# Altium schematic sheet PT1003.SchDoc
size A3
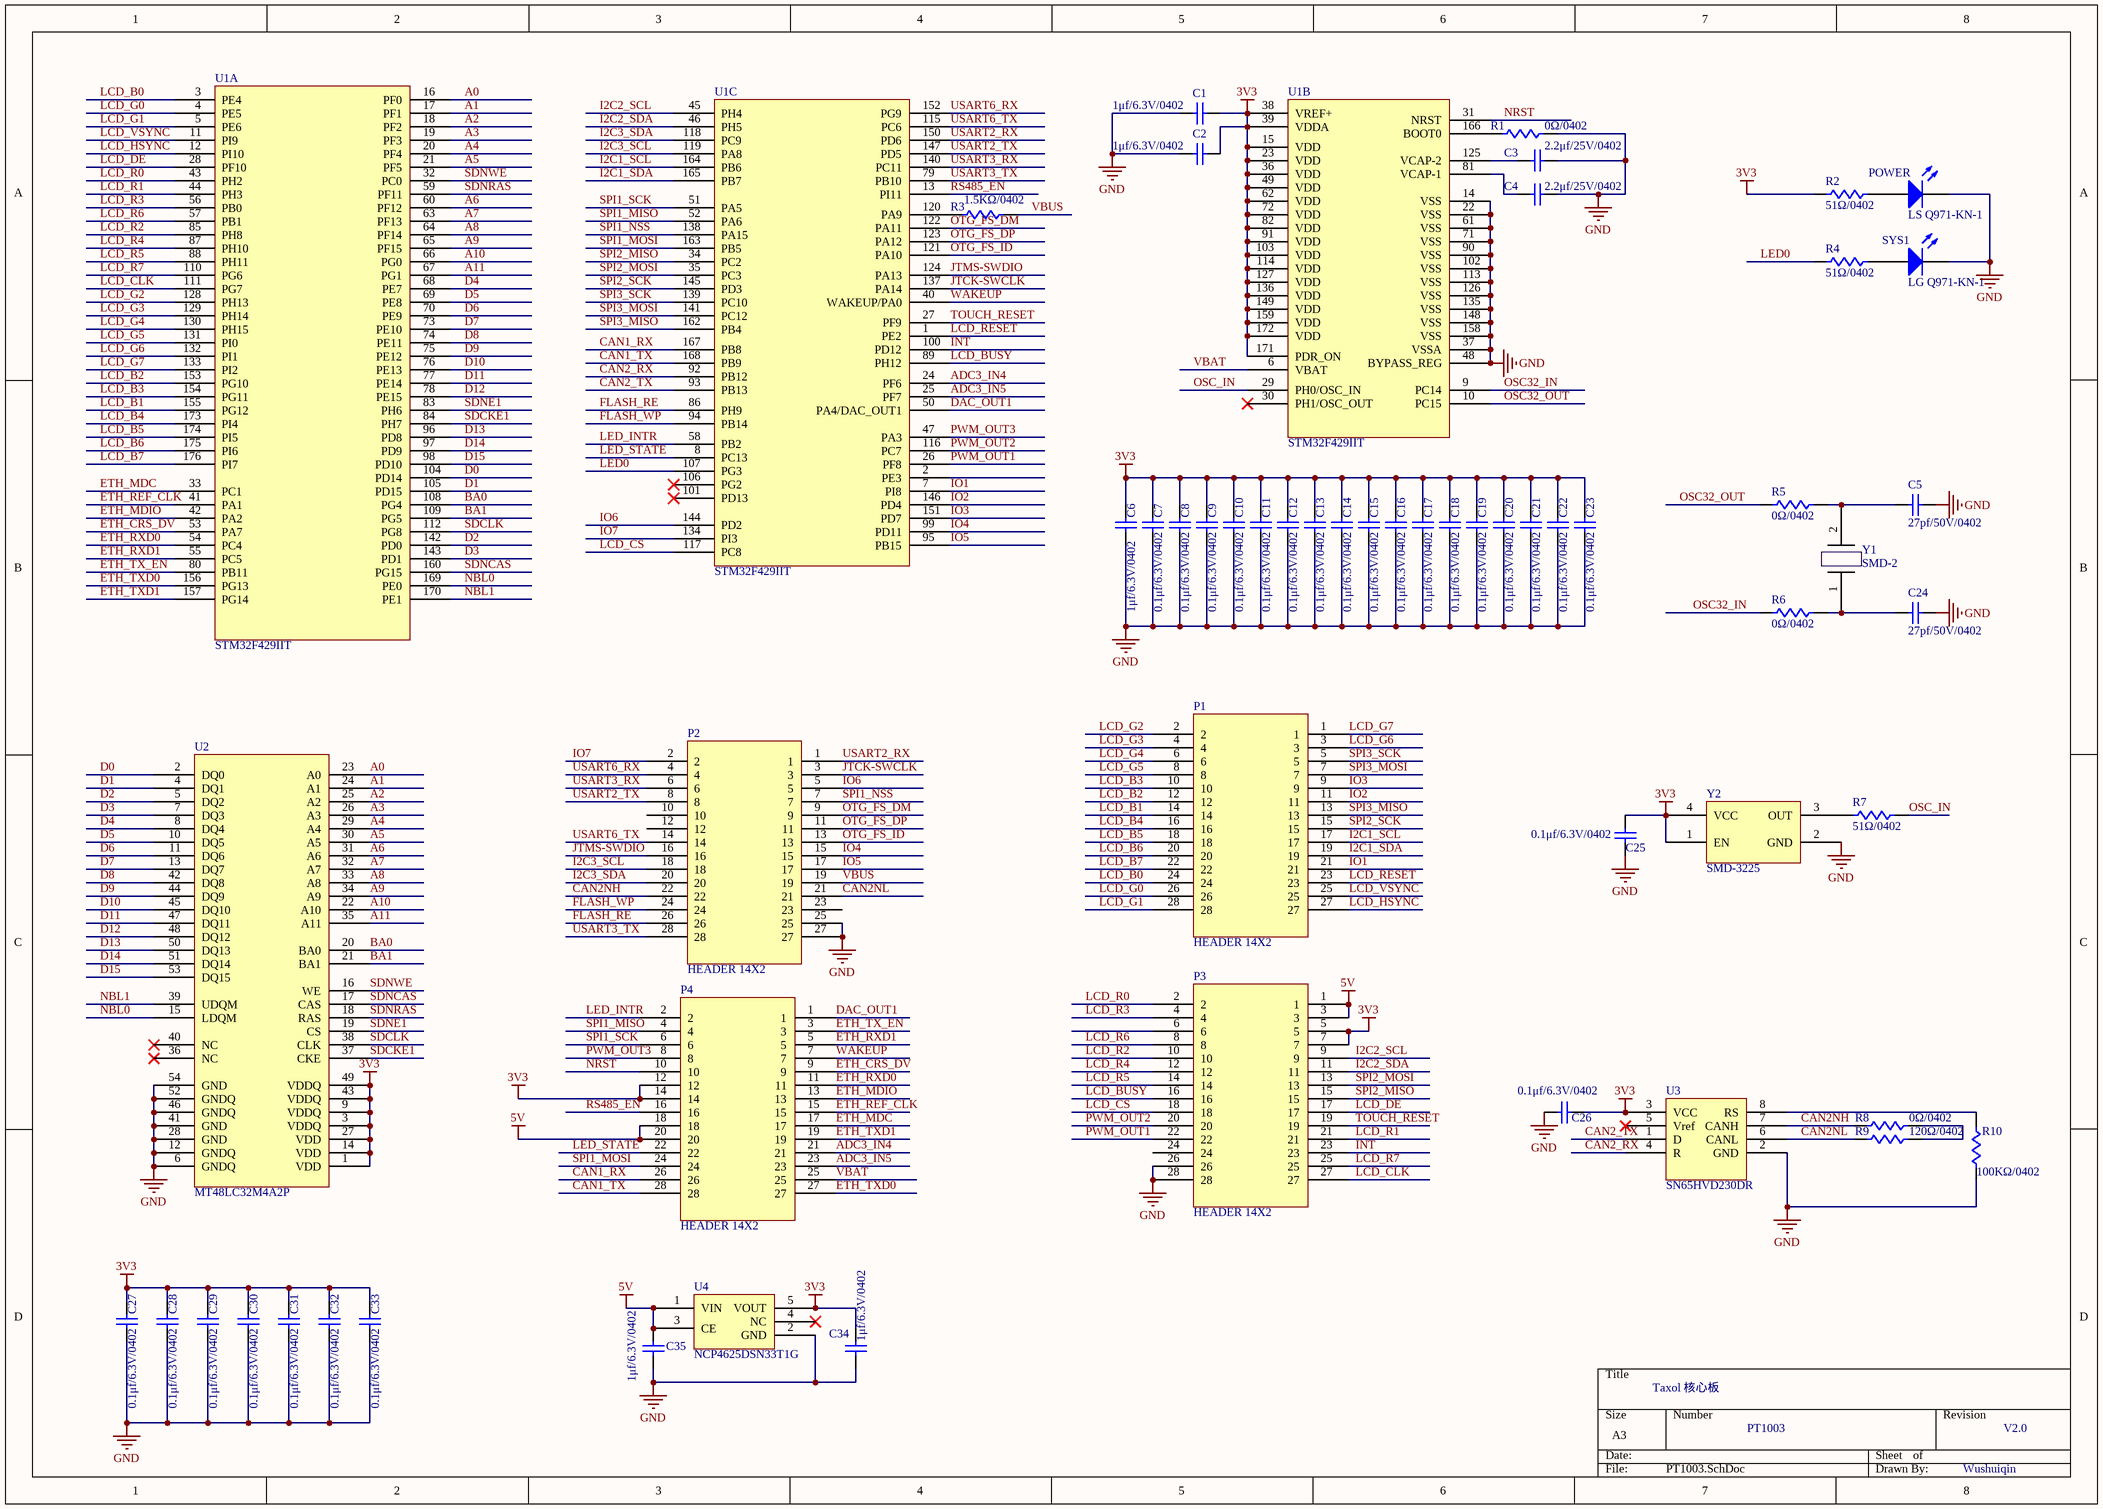
[diagram p0: PT1003.SchDoc]

## Parts
C1  1μf/6.3V/0402  [CAPACITOR_0402]
C2  1μf/6.3V/0402  [CAPACITOR_0402]
C3  2.2μf/25V/0402  [CAPACITOR_0402]
C4  2.2μf/25V/0402  [CAPACITOR_0402]
C5  27pf/50V/0402  [CAPACITOR_0402]
C6  1μf/6.3V/0402  [CAPACITOR_0402]
C7  0.1μf/6.3V/0402  [CAPACITOR_0402]
C8  0.1μf/6.3V/0402  [CAPACITOR_0402]
C9  0.1μf/6.3V/0402  [CAPACITOR_0402]
C10  0.1μf/6.3V/0402  [CAPACITOR_0402]
C11  0.1μf/6.3V/0402  [CAPACITOR_0402]
C12  0.1μf/6.3V/0402  [CAPACITOR_0402]
C13  0.1μf/6.3V/0402  [CAPACITOR_0402]
C14  0.1μf/6.3V/0402  [CAPACITOR_0402]
C15  0.1μf/6.3V/0402  [CAPACITOR_0402]
C16  0.1μf/6.3V/0402  [CAPACITOR_0402]
C17  0.1μf/6.3V/0402  [CAPACITOR_0402]
C18  0.1μf/6.3V/0402  [CAPACITOR_0402]
C19  0.1μf/6.3V/0402  [CAPACITOR_0402]
C20  0.1μf/6.3V/0402  [CAPACITOR_0402]
C21  0.1μf/6.3V/0402  [CAPACITOR_0402]
C22  0.1μf/6.3V/0402  [CAPACITOR_0402]
C23  0.1μf/6.3V/0402  [CAPACITOR_0402]
C24  27pf/50V/0402  [CAPACITOR_0402]
C25  0.1μf/6.3V/0402  [CAPACITOR_0402]
C26  0.1μf/6.3V/0402  [CAPACITOR_0402]
C27  0.1μf/6.3V/0402  [CAPACITOR_0402]
C28  0.1μf/6.3V/0402  [CAPACITOR_0402]
C29  0.1μf/6.3V/0402  [CAPACITOR_0402]
C30  0.1μf/6.3V/0402  [CAPACITOR_0402]
C31  0.1μf/6.3V/0402  [CAPACITOR_0402]
C32  0.1μf/6.3V/0402  [CAPACITOR_0402]
C33  0.1μf/6.3V/0402  [CAPACITOR_0402]
C34  1μf/6.3V/0402  [CAPACITOR_0402]
C35  1μf/6.3V/0402  [CAPACITOR_0402]
P1  HEADER 14X2  [PIN]
P2  HEADER 14X2  [PIN_1]
P3  HEADER 14X2  [PIN]
P4  HEADER 14X2  [PIN_1]
POWER  LS Q971-KN-1  [LED]
R1  0Ω/0402  [RESSISTANCE_0402]
R2  51Ω/0402  [RESSISTANCE_0402]
R3  1.5KΩ/0402  [RESSISTANCE_0402]
R4  51Ω/0402  [RESSISTANCE_0402]
R5  0Ω/0402  [RESSISTANCE_0402]
R6  0Ω/0402  [RESSISTANCE_0402]
R7  51Ω/0402  [RESSISTANCE_0402]
R8  0Ω/0402  [RESSISTANCE_0402]
R9  120Ω/0402  [RESSISTANCE_0402]
R10  100KΩ/0402  [RESSISTANCE_0402]
SYS1  LG Q971-KN-1  [LED]
U1  STM32F429IIT  [STM32F429IIT]  (parts A,B,C of 3)
U2  MT48LC32M4A2P  [IS42S16400J]
U3  SN65HVD230DR  [SN65HVD230]
U4  NCP4625DSN33T1G  [NCP4625DSN33T1G]
Y1  SMD-2  [SMD-2]
Y2  SMD-3225  [X032]

## Nets
3V3: C1.2 C2.2 C6.2 C7.2 C8.2 C9.2 C10.2 C11.2 C12.2 C13.2 C14.2 C15.2 C16.2 C17.2 C18.2 C19.2 C20.2 C21.2 C22.2 C23.2 C25.2 C26.1 C27.2 C28.2 C29.2 C30.2 C31.2 C32.2 C33.2 C34.2 P3.5 P3.7 P4.12 P4.14 R2.1 U1.15(VDD) U1.23(VDD) U1.36(VDD) U1.38(VREF+) U1.39(VDDA) U1.49(VDD) U1.62(VDD) U1.72(VDD) U1.82(VDD) U1.91(VDD) U1.103(VDD) U1.114(VDD) U1.127(VDD) U1.136(VDD) U1.149(VDD) U1.159(VDD) U1.171(PDR_ON) U1.172(VDD) U2.1(VDD) U2.3(VDDQ) U2.9(VDDQ) U2.14(VDD) U2.27(VDD) U2.43(VDDQ) U2.49(VDDQ) U3.3(VCC) U4.5(VOUT) Y2.1(EN) Y2.4(VCC)
5V: C35.2 P3.1 P3.3 P4.18 P4.20 U4.1(VIN) U4.3(CE)
GND: C1.1 C2.1 C3.1 C4.1 C5.2 C6.1 C7.1 C8.1 C9.1 C10.1 C11.1 C12.1 C13.1 C14.1 C15.1 C16.1 C17.1 C18.1 C19.1 C20.1 C21.1 C22.1 C23.1 C24.2 C25.1 C26.2 C27.1 C28.1 C29.1 C30.1 C31.1 C32.1 C33.1 C34.1 C35.1 P2.25 P2.27 P3.26 P3.28 POWER.2(K) R1.2 R10.1 SYS1.2(K) U1.14(VSS) U1.22(VSS) U1.37(VSSA) U1.48(BYPASS_REG) U1.61(VSS) U1.71(VSS) U1.90(VSS) U1.102(VSS) U1.113(VSS) U1.126(VSS) U1.135(VSS) U1.148(VSS) U1.158(VSS) U2.6(GNDQ) U2.12(GNDQ) U2.28(GND) U2.41(GND) U2.46(GNDQ) U2.52(GNDQ) U2.54(GND) U3.2(GND) U4.2(GND) Y2.2(GND)
A0: U1.16(PF0) U2.23(A0)
A1: U1.17(PF1) U2.24(A1)
A2: U1.18(PF2) U2.25(A2)
A3: U1.19(PF3) U2.26(A3)
A4: U1.20(PF4) U2.29(A4)
A5: U1.21(PF5) U2.30(A5)
A6: U1.60(PF12) U2.31(A6)
A7: U1.63(PF13) U2.32(A7)
A8: U1.64(PF14) U2.33(A8)
A9: U1.65(PF15) U2.34(A9)
A10: U1.66(PG0) U2.22(A10)
A11: U1.67(PG1) U2.35(A11)
ADC3_IN4: P4.21 U1.24(PF6)
ADC3_IN5: P4.23 U1.25(PF7)
BA0: U1.108(PG4) U2.20(BA0)
BA1: U1.109(PG5) U2.21(BA1)
CAN1_RX: P4.26 U1.167(PB8)
CAN1_TX: P4.28 U1.168(PB9)
CAN2_RX: U1.92(PB12) U3.4(R)
CAN2_TX: U1.93(PB13) U3.1(D)
CAN2NH: P2.22 R8.1 U3.7(CANH)
CAN2NL: P2.21 R9.1 U3.6(CANL)
D0: U1.104(PD14) U2.2(DQ0)
D1: U1.105(PD15) U2.4(DQ1)
D2: U1.142(PD0) U2.5(DQ2)
D3: U1.143(PD1) U2.7(DQ3)
D4: U1.68(PE7) U2.8(DQ4)
D5: U1.69(PE8) U2.10(DQ5)
D6: U1.70(PE9) U2.11(DQ6)
D7: U1.73(PE10) U2.13(DQ7)
D8: U1.74(PE11) U2.42(DQ8)
D9: U1.75(PE12) U2.44(DQ9)
D10: U1.76(PE13) U2.45(DQ10)
D11: U1.77(PE14) U2.47(DQ11)
D12: U1.78(PE15) U2.48(DQ12)
D13: U1.96(PD8) U2.50(DQ13)
D14: U1.97(PD9) U2.51(DQ14)
D15: U1.98(PD10) U2.53(DQ15)
DAC_OUT1: P4.1 U1.50(PA4/DAC_OUT1)
ETH_CRS_DV: P4.9 U1.53(PA7)
ETH_MDC: P4.17 U1.33(PC1)
ETH_MDIO: P4.13 U1.42(PA2)
ETH_REF_CLK: P4.15 U1.41(PA1)
ETH_RXD0: P4.11 U1.54(PC4)
ETH_RXD1: P4.5 U1.55(PC5)
ETH_TX_EN: P4.3 U1.80(PB11)
ETH_TXD0: P4.27 U1.156(PG13)
ETH_TXD1: P4.19 U1.157(PG14)
FLASH_RE: P2.26 U1.86(PH9)
FLASH_WP: P2.24 U1.94(PB14)
I2C1_SCL: P1.17 U1.164(PB6)
I2C1_SDA: P1.19 U1.165(PB7)
I2C2_SCL: P3.9 U1.45(PH4)
I2C2_SDA: P3.11 U1.46(PH5)
I2C3_SCL: P2.18 U1.119(PA8)
I2C3_SDA: P2.20 U1.118(PC9)
INT: P3.23 U1.100(PD12)
IO1: P1.21 U1.7(PI8)
IO2: P1.11 U1.146(PD4)
IO3: P1.9 U1.151(PD7)
IO4: P2.15 U1.99(PD11)
IO5: P2.17 U1.95(PB15)
IO6: P2.5 U1.144(PD2)
IO7: P2.2 U1.134(PI3)
JTCK-SWCLK: P2.3 U1.137(PA14)
JTMS-SWDIO: P2.16 U1.124(PA13)
LCD_B0: P1.24 U1.3(PE4)
LCD_B1: P1.14 U1.155(PG12)
LCD_B2: P1.12 U1.153(PG10)
LCD_B3: P1.10 U1.154(PG11)
LCD_B4: P1.16 U1.173(PI4)
LCD_B5: P1.18 U1.174(PI5)
LCD_B6: P1.20 U1.175(PI6)
LCD_B7: P1.22 U1.176(PI7)
LCD_BUSY: P3.16 U1.89(PH12)
LCD_CLK: P3.27 U1.111(PG7)
LCD_CS: P3.18 U1.117(PC8)
LCD_DE: P3.17 U1.28(PF10)
LCD_G0: P1.26 U1.4(PE5)
LCD_G1: P1.28 U1.5(PE6)
LCD_G2: P1.2 U1.128(PH13)
LCD_G3: P1.4 U1.129(PH14)
LCD_G4: P1.6 U1.130(PH15)
LCD_G5: P1.8 U1.131(PI0)
LCD_G6: P1.3 U1.132(PI1)
LCD_G7: P1.1 U1.133(PI2)
LCD_HSYNC: P1.27 U1.12(PI10)
LCD_R0: P3.2 U1.43(PH2)
LCD_R1: P3.21 U1.44(PH3)
LCD_R2: P3.10 U1.85(PH8)
LCD_R3: P3.4 U1.56(PB0)
LCD_R4: P3.12 U1.87(PH10)
LCD_R5: P3.14 U1.88(PH11)
LCD_R6: P3.8 U1.57(PB1)
LCD_R7: P3.25 U1.110(PG6)
LCD_RESET: P1.23 U1.1(PE2)
LCD_VSYNC: P1.25 U1.11(PI9)
LED0: R4.1 U1.107(PG3)
LED_INTR: P4.2 U1.58(PB2)
LED_STATE: P4.22 U1.8(PC13)
NBL0: U1.169(PE0) U2.15(LDQM)
NBL1: U1.170(PE1) U2.39(UDQM)
NRST: P4.10 U1.31(NRST)
OSC32_IN: R6.1 U1.9(PC14)
OSC32_OUT: R5.1 U1.10(PC15)
OSC_IN: R7.2 U1.29(PH0/OSC_IN)
OTG_FS_DM: P2.9 U1.122(PA11)
OTG_FS_DP: P2.11 U1.123(PA12)
OTG_FS_ID: P2.13 U1.121(PA10)
PWM_OUT1: P3.22 U1.26(PF8)
PWM_OUT2: P3.20 U1.116(PC7)
PWM_OUT3: P4.8 U1.47(PA3)
RS485_EN: P4.16 U1.13(PI11)
SDCKE1: U1.84(PH7) U2.37(CKE)
SDCLK: U1.112(PG8) U2.38(CLK)
SDNCAS: U1.160(PG15) U2.17(CAS)
SDNE1: U1.83(PH6) U2.19(CS)
SDNRAS: U1.59(PF11) U2.18(RAS)
SDNWE: U1.32(PC0) U2.16(WE)
SPI1_MISO: P4.4 U1.52(PA6)
SPI1_MOSI: P4.24 U1.163(PB5)
SPI1_NSS: P2.7 U1.138(PA15)
SPI1_SCK: P4.6 U1.51(PA5)
SPI2_MISO: P3.15 U1.34(PC2)
SPI2_MOSI: P3.13 U1.35(PC3)
SPI2_SCK: P1.15 U1.145(PD3)
SPI3_MISO: P1.13 U1.162(PB4)
SPI3_MOSI: P1.7 U1.141(PC12)
SPI3_SCK: P1.5 U1.139(PC10)
TOUCH_RESET: P3.19 U1.27(PF9)
USART2_RX: P2.1 U1.150(PD6)
USART2_TX: P2.8 U1.147(PD5)
USART3_RX: P2.6 U1.140(PC11)
USART3_TX: P2.28 U1.79(PB10)
USART6_RX: P2.4 U1.152(PG9)
USART6_TX: P2.14 U1.115(PC6)
VBAT: P4.25 U1.6(VBAT)
VBUS: P2.19 R3.2
WAKEUP: P4.7 U1.40(WAKEUP/PA0)
NetC3_2: C3.2 U1.125(VCAP-2)
NetC4_2: C4.2 U1.81(VCAP-1)
NetC5_1: C5.1 R5.2 Y1.2
NetC24_1: C24.1 R6.2 Y1.1
NetPOWER_1: POWER.1(A) R2.2
NetR1_1: R1.1 U1.166(BOOT0)
NetR3_1: R3.1 U1.120(PA9)
NetR4_2: R4.2 SYS1.1(A)
NetR7_1: R7.1 Y2.3(OUT)
NetR8_2: R8.2 R9.2
NetR10_2: R10.2 U3.8(RS)

Not connected (* = marked no-connect by the designer): P2 10 12 23; P3 6 24; U1 2(PE3) 30(PH1/OSC_OUT)* 101(PD13)* 106(PG2)*; U2 36(NC)* 40(NC)*; U3 5(Vref)*; U4 4(NC)*

## Notes on the sheet
- Taxol 核心板
- PT1003
- V2.0
- Wushuiqin

## Library data of the parts
C1 C2 C6 C34 C35 = CAPACITOR_0603: Manufacturer: Murata; Model: GRM155F50J105ZE01D; Value: 1μf/6.3V/0402
C3 C4 = CAPACITOR_0603: Manufacturer: TDK; Model: C1005X5R1E225K050BC; Value: 2.2μf/25V/0402
C5 C24 = CAPACITOR: Manufacturer: AVX; Model: 04025A270FAT2A; Value: 27pf/50V/0402
C7-C23 C25-C33 = CAPACITOR_0603: Manufacturer: TDK; Model: C1005X5R0J104K050BA; Value: 0.1μf/6.3V/0402
P1 P3 = PIN: Model: 2*14P; Value: 2*14P/2mm/Double pin
P2 P4 = PIN_1: Model: 2*14P; Value: 2*14P/2mm/Double pin
POWER = LED: LED_G; Manufacturer: OSRAM; Value: RED 1.9V; Model: LS Q971-KN-1
R1 R5 R8 = RESISTANCE: Manufacturer: VISHAY; Model: CRCW04020000Z0ED; Value: 0Ω/0402
R2 R4 R7 = RESISTANCE: Manufacturer: VISHAY; Model: CRCW040251R0FKED; Value: 51Ω/0402
R3 = RESISTANCE: Manufacturer: Vishay; Model: CRCW04021K50FKED; Value: 1.5KΩ/0402
R6 = RESISTANCE: Manufacturer: Vishay; Model: CRCW04020000Z0ED; Value: 0Ω/0402
R9 = RESISTANCE: Manufacturer: Vishay; Model: CRCW0402120RJNEDHP; Value: 120Ω/0402
R10 = RESISTANCE: Manufacturer: VISHAY; Model: CRCW0402100KFKED; Value: 100KΩ/0402
SYS1 = LED: LED_G; Manufacturer: OSRAM; Value: GREEN 2.2V; Model: LG Q971-KN-1
U1 = STM32F429IIT: Manufacturer: ST; Value: 176-LQFP; Model: STM32F429IIT
U2 = IS42S16400J: SDRAM; Manufacturer: MICRON; Value: 2Meg Bits * 16Bits * 4Banks,TSOP; Model: MT48LC32M4A2P
U3 = SN65HVD230DR: CAN; Manufacturer: TEXAS INSTRUMENTS; Value: 3.3V CAN; Model: SN65HVD230DR
U4 = NCP4625DSN33T1G: Manufacturer: ON; Value: 3.3V/SOT-23-5; Model: NCP4625DSN33T1G
Y1 = CC7V-TIA: Manufacturer: MICRO CRYSTAL SWITZERLAND; Value: 32.768KHZ 2P 2012; Model: SMD-2
Y2 = X075_8MHZ: 4-Pin; Manufacturer: 深圳市金丰瑞电子有限公司; Value: 8MHZ 工业级 3225; Model: SMD-3225